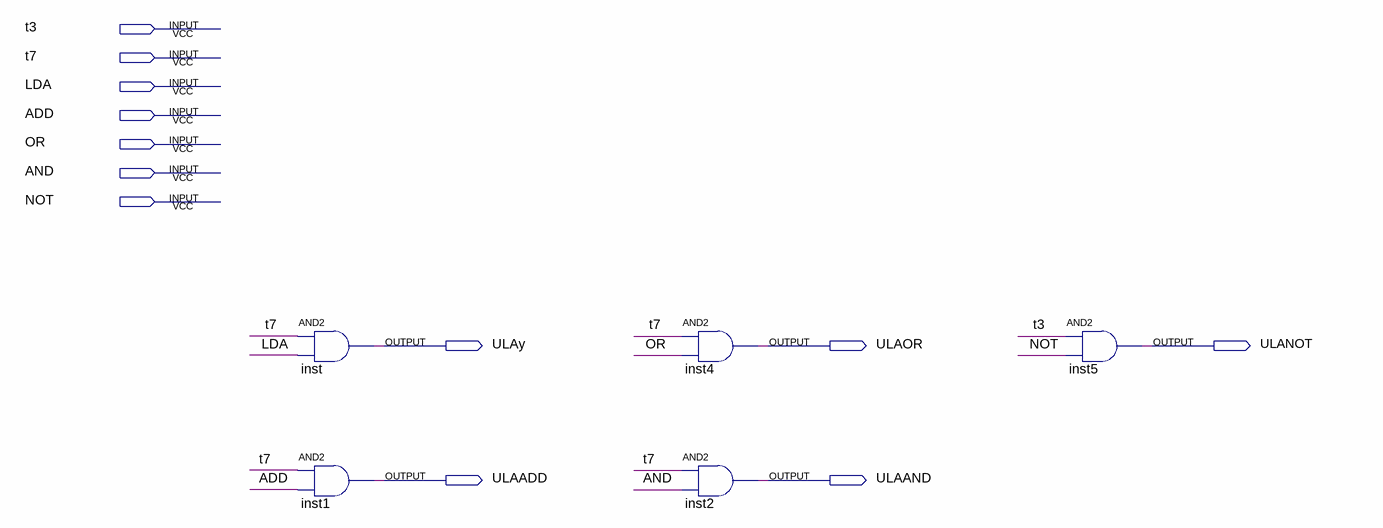
[diagram p0: schematic sheet]
// Quartus schematic ULAcontrol.bdf as structural Verilog: 5 symbols, 12 pins
module ULAcontrol (
  input  t3,
  input  t7,
  input  LDA,
  input  ADD,
  input  OR,
  input  AND,
  input  NOT,
  output ULAy,
  output ULAOR,
  output ULANOT,
  output ULAADD,
  output ULAAND
);

  and inst (ULAy, t7, LDA);
  and inst1 (ULAADD, t7, ADD);
  and inst4 (ULAOR, t7, OR);
  and inst2 (ULAAND, t7, AND);
  and inst5 (ULANOT, t3, NOT);
endmodule
